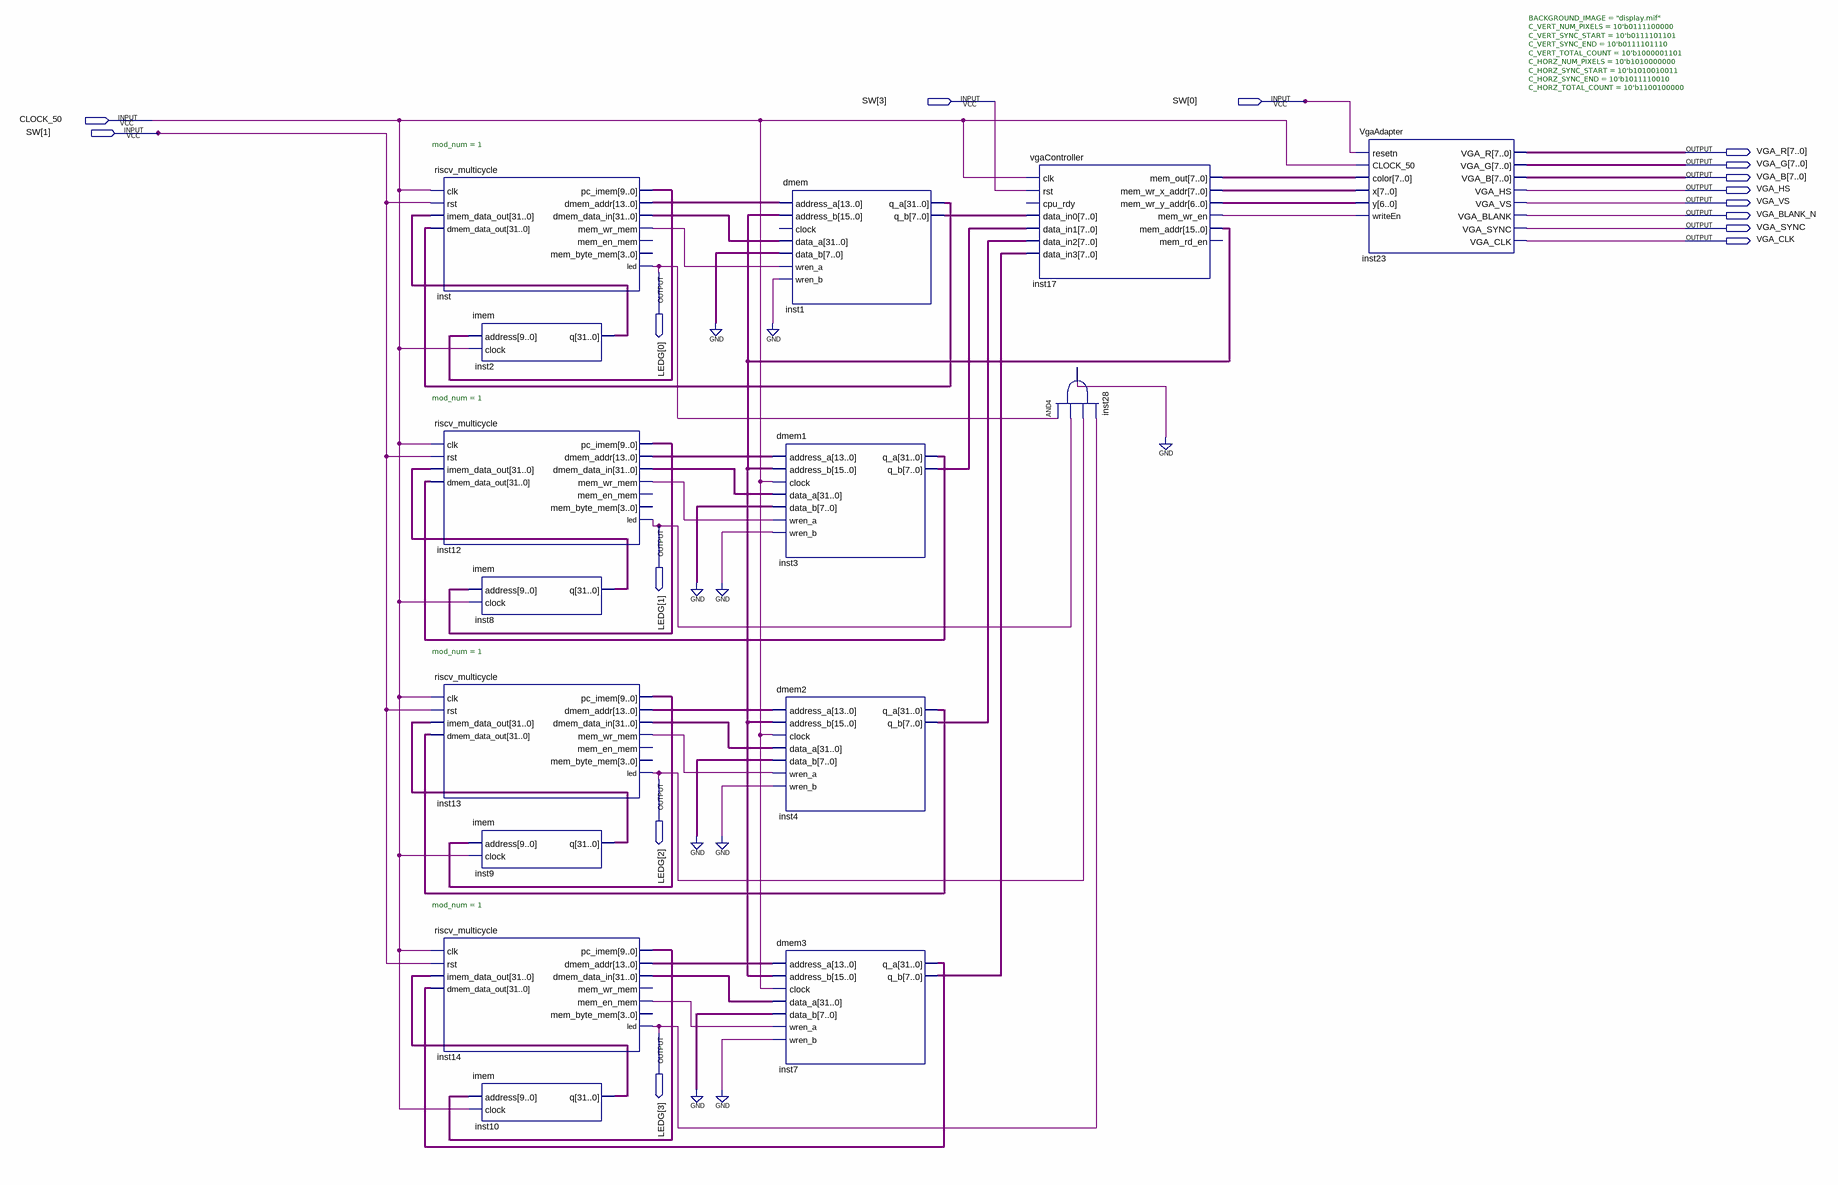
[diagram p0: schematic sheet]
// Quartus schematic RISCV_MULTICORE.bdf as structural Verilog: 15 symbols, 16 pins
module RISCV_MULTICORE (
  input  [3:0] SW,
  input  CLOCK_50,
  output [7:0] VGA_R,
  output [7:0] VGA_G,
  output [7:0] VGA_B,
  output VGA_HS,
  output VGA_VS,
  output VGA_BLANK_N,
  output VGA_SYNC,
  output VGA_CLK,
  output [3:0] LEDG
);

  wire inst12_mem_wr_mem, inst13_mem_wr_mem, inst14_mem_en_mem, inst17_mem_wr_en, inst28_out, inst_mem_wr_mem;
  wire [6:0] inst17_mem_wr_y_addr;
  wire [7:0] inst1_q_b, inst3_q_b, inst4_q_b, inst7_q_b, inst17_mem_out, inst17_mem_wr_x_addr;
  wire [9:0] inst12_pc_imem, inst13_pc_imem, inst14_pc_imem, inst_pc_imem;
  wire [13:0] inst12_dmem_addr, inst13_dmem_addr, inst14_dmem_addr, inst_dmem_addr;
  wire [15:0] inst17_mem_addr;
  wire [31:0] inst1_q_a, inst2_q, inst3_q_a, inst4_q_a, inst7_q_a, inst8_q, inst9_q, inst10_q,
       inst12_dmem_data_in, inst13_dmem_data_in, inst14_dmem_data_in, inst_dmem_data_in;

  riscv_multicycle #(.mod_num(1)) inst (
    .clk(CLOCK_50), .rst(SW[1]), .imem_data_out(inst2_q), .dmem_data_out(inst1_q_a), .pc_imem(inst_pc_imem),
    .dmem_addr(inst_dmem_addr), .dmem_data_in(inst_dmem_data_in), .mem_wr_mem(inst_mem_wr_mem), .led(LEDG[0]));  // open: mem_en_mem, mem_byte_mem
  riscv_multicycle #(.mod_num(1)) inst12 (
    .clk(CLOCK_50), .rst(SW[1]), .imem_data_out(inst8_q), .dmem_data_out(inst3_q_a),
    .pc_imem(inst12_pc_imem), .dmem_addr(inst12_dmem_addr), .dmem_data_in(inst12_dmem_data_in),
    .mem_wr_mem(inst12_mem_wr_mem), .led(LEDG[1]));  // open: mem_en_mem, mem_byte_mem
  riscv_multicycle #(.mod_num(1)) inst13 (
    .clk(CLOCK_50), .rst(SW[1]), .imem_data_out(inst9_q), .dmem_data_out(inst4_q_a),
    .pc_imem(inst13_pc_imem), .dmem_addr(inst13_dmem_addr), .dmem_data_in(inst13_dmem_data_in),
    .mem_wr_mem(inst13_mem_wr_mem), .led(LEDG[2]));  // open: mem_en_mem, mem_byte_mem
  riscv_multicycle #(.mod_num(1)) inst14 (
    .clk(CLOCK_50), .rst(SW[1]), .imem_data_out(inst10_q), .dmem_data_out(inst7_q_a),
    .pc_imem(inst14_pc_imem), .dmem_addr(inst14_dmem_addr), .dmem_data_in(inst14_dmem_data_in),
    .mem_en_mem(inst14_mem_en_mem), .led(LEDG[3]));  // open: mem_wr_mem, mem_byte_mem
  imem inst2 (.address(inst_pc_imem), .clock(CLOCK_50), .q(inst2_q));
  imem inst8 (.address(inst12_pc_imem), .clock(CLOCK_50), .q(inst8_q));
  imem inst9 (.address(inst13_pc_imem), .clock(CLOCK_50), .q(inst9_q));
  imem inst10 (.address(inst14_pc_imem), .clock(CLOCK_50), .q(inst10_q));
  dmem inst1 (
    .address_a(inst_dmem_addr), .address_b(inst17_mem_addr), .data_a(inst_dmem_data_in), .data_b({8{1'b0}}),
    .wren_a(inst_mem_wr_mem), .wren_b(1'b0), .q_a(inst1_q_a), .q_b(inst1_q_b));  // open: clock
  dmem1 inst3 (
    .address_a(inst12_dmem_addr), .address_b(inst17_mem_addr), .clock(CLOCK_50),
    .data_a(inst12_dmem_data_in), .data_b({8{1'b0}}), .wren_a(inst12_mem_wr_mem), .wren_b(1'b0),
    .q_a(inst3_q_a), .q_b(inst3_q_b));
  dmem2 inst4 (
    .address_a(inst13_dmem_addr), .address_b(inst17_mem_addr), .clock(CLOCK_50),
    .data_a(inst13_dmem_data_in), .data_b({8{1'b0}}), .wren_a(inst13_mem_wr_mem), .wren_b(1'b0),
    .q_a(inst4_q_a), .q_b(inst4_q_b));
  dmem3 inst7 (
    .address_a(inst14_dmem_addr), .address_b(inst17_mem_addr), .clock(CLOCK_50),
    .data_a(inst14_dmem_data_in), .data_b({8{1'b0}}), .wren_a(inst14_mem_en_mem), .wren_b(1'b0),
    .q_a(inst7_q_a), .q_b(inst7_q_b));
  vgaController inst17 (
    .clk(CLOCK_50), .rst(SW[3]), .data_in0(inst1_q_b), .data_in1(inst3_q_b), .data_in2(inst4_q_b),
    .data_in3(inst7_q_b), .mem_out(inst17_mem_out), .mem_wr_x_addr(inst17_mem_wr_x_addr),
    .mem_wr_y_addr(inst17_mem_wr_y_addr), .mem_wr_en(inst17_mem_wr_en), .mem_addr(inst17_mem_addr));  // open: cpu_rdy, mem_rd_en
  and inst28 (inst28_out, LEDG[0], LEDG[1], LEDG[2], LEDG[3]);
  VgaAdapter #(.BACKGROUND_IMAGE("display.mif"), .C_VERT_NUM_PIXELS(10'b0111100000), .C_VERT_SYNC_START(10'b0111101101), .C_VERT_SYNC_END(10'b0111101110), .C_VERT_TOTAL_COUNT(10'b1000001101), .C_HORZ_NUM_PIXELS(10'b1010000000), .C_HORZ_SYNC_START(10'b1010010011), .C_HORZ_SYNC_END(10'b1011110010), .C_HORZ_TOTAL_COUNT(10'b1100100000)) inst23 (
    .resetn(SW[0]), .CLOCK_50(CLOCK_50), .color(inst17_mem_out), .x(inst17_mem_wr_x_addr),
    .y(inst17_mem_wr_y_addr), .writeEn(inst17_mem_wr_en), .VGA_R(VGA_R), .VGA_G(VGA_G), .VGA_B(VGA_B),
    .VGA_HS(VGA_HS), .VGA_VS(VGA_VS), .VGA_BLANK(VGA_BLANK_N), .VGA_SYNC(VGA_SYNC), .VGA_CLK(VGA_CLK));
  // also tied to GND on the sheet: inst28_out
endmodule
